# EAGLE schematic voltage_sensor_v0.2 (EAGLE 9.6.2)
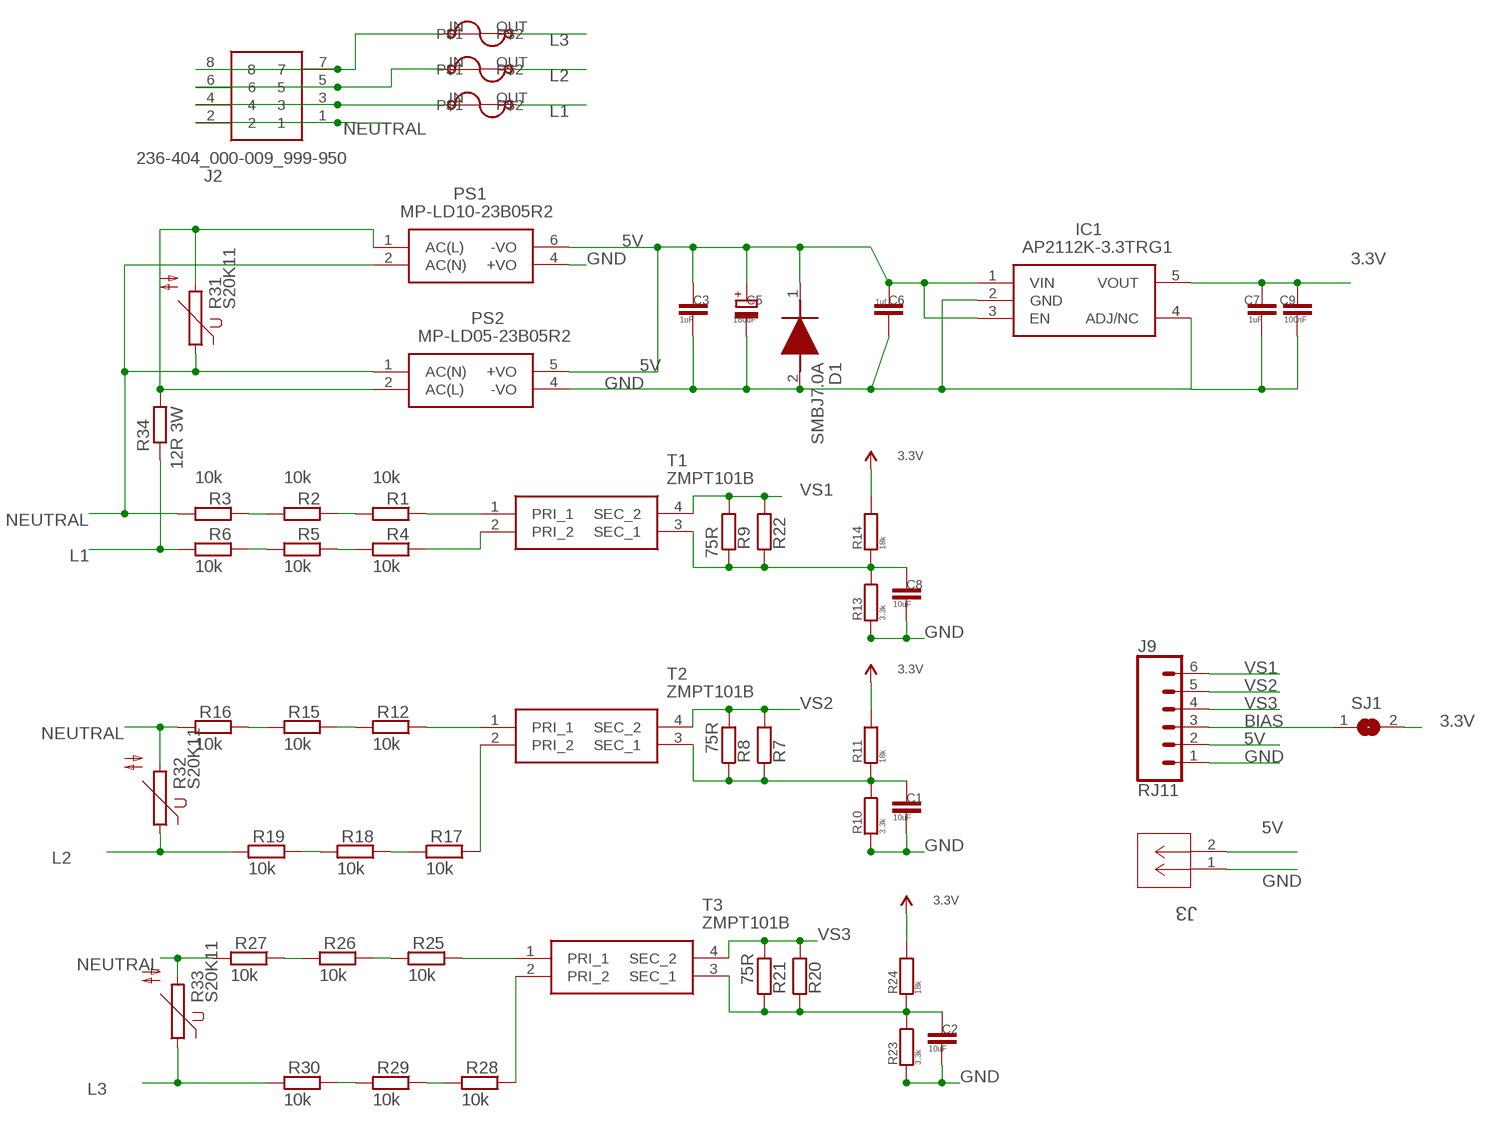
[diagram p0: schematic, sheet 1]

## Parts
C1  10uF  C-EUC0603  [C0603]
C2  10uF  C-EUC0603  [C0603]
C3  1uF  C-EUC0603  [C0603]
C5  180uF  CPOL-EUB  [PANASONIC_B]
C6  1uf  C-EUC0603  [C0603]
C7  1uF  C-EUC0603  [C0603]
C8  10uF  C-EUC0603  [C0603]
C9  100nF  C-EUC0603  [C0603]
D1  SMBJ7.0A  [DIOM5336X244N]
F1  2A/250V  BEL1AFUSE  [BELFUSE1A]
F2  2A/250V  BEL1AFUSE  [BELFUSE1A]
F3  2A/250V  BEL1AFUSE  [BELFUSE1A]
IC1  AP2112K-3.3TRG1  [SOT95P282X130-5N]
J2  236-404_000-009_999-950  [236404000009999950]
J3  MC000048  [CONN2_00048_MTC]
J9  RJ11  RJ11-6  [RJ11-6]
PS1  MP-LD10-23B05R2  MP-LD10-23B12R2  [MPLD1023B12R2]
PS2  MP-LD05-23B05R2  MP-LD05-23B03R2  [MPLD0523B03R2]
R1  10k  R-EU_R0603  [R0603]
R2  10k  R-EU_R0603  [R0603]
R3  10k  R-EU_R0603  [R0603]
R4  10k  R-EU_R0603  [R0603]
R5  10k  R-EU_R0603  [R0603]
R6  10k  R-EU_R0603  [R0603]
R7  R-EU_0204/7  [0204/7]
R8  75R  R-EU_R0603  [R0603]
R9  75R  R-EU_R0603  [R0603]
R10  3.3k  R-EU_R0603  [R0603]
R11  18k  R-EU_R0603  [R0603]
R12  10k  R-EU_R0603  [R0603]
R13  3.3k  R-EU_R0603  [R0603]
R14  18k  R-EU_R0603  [R0603]
R15  10k  R-EU_R0603  [R0603]
R16  10k  R-EU_R0603  [R0603]
R17  10k  R-EU_R0603  [R0603]
R18  10k  R-EU_R0603  [R0603]
R19  10k  R-EU_R0603  [R0603]
R20  R-EU_0204/7  [0204/7]
R21  75R  R-EU_R0603  [R0603]
R22  R-EU_0204/7  [0204/7]
R23  3.3k  R-EU_R0603  [R0603]
R24  18k  R-EU_R0603  [R0603]
R25  10k  R-EU_R0603  [R0603]
R26  10k  R-EU_R0603  [R0603]
R27  10k  R-EU_R0603  [R0603]
R28  10k  R-EU_R0603  [R0603]
R29  10k  R-EU_R0603  [R0603]
R30  10k  R-EU_R0603  [R0603]
R31  S20K11  [S20K11]
R32  S20K11  [S20K11]
R33  S20K11  [S20K11]
R34  12R 3W  R-EU_R2512  [R2512]
SJ1  SJ  [SJ]
T1  ZMPT101B  [ZMPT101B]
T2  ZMPT101B  [ZMPT101B]
T3  ZMPT101B  [ZMPT101B]

## Nets
3.3V: C7.1 C9.1 IC1.5(VOUT) R11.2 R14.2 R24.2 SJ1.2
5V: C3.1 C5.+ C6.1 D1.1(K) IC1.1(VIN) IC1.3(EN) J3.2 J9.2 PS1.6(-VO) PS2.5(+VO)
BIAS: J9.3 SJ1.1
GND: C1.2 C2.2 C3.2 C5.- C6.2 C7.2 C8.2 C9.2 D1.2(A) IC1.2(GND) IC1.4(ADJ/NC) J3.1 J9.1 PS1.4(+VO) PS2.4(-VO) R10.2 R13.2 R23.2
L1: F1.OUT R6.2 R34.1
L2: F2.OUT R19.2 R32.1
L3: F3.OUT R30.2 R33.1
N$1: R1.1 T1.1(PRI_1)
N$2: R4.1 T1.2(PRI_2)
N$3: R1.2 R2.1
N$4: R4.2 R5.1
N$5: R5.2 R6.1
N$6: R2.2 R3.1
N$7: F1.IN J2.3 J2.4
N$8: F2.IN J2.5 J2.6
N$9: C1.1 R7.1 R8.1 R10.1 R11.1 T2.3(SEC_1)
N$10: R12.1 T2.1(PRI_1)
N$11: R17.1 T2.2(PRI_2)
N$12: R12.2 R15.1
N$13: R17.2 R18.1
N$14: R18.2 R19.1
N$15: R15.2 R16.1
N$16: F3.IN J2.7 J2.8
N$17: PS1.1(AC(L)) PS2.2(AC(L)) R31.2 R34.2
N$18: C2.1 R20.1 R21.1 R23.1 R24.1 T3.3(SEC_1)
N$19: R25.1 T3.1(PRI_1)
N$20: R28.1 T3.2(PRI_2)
N$21: R25.2 R26.1
N$22: R28.2 R29.1
N$23: R29.2 R30.1
N$24: R26.2 R27.1
N$25: C8.1 R9.1 R13.1 R14.1 R22.1 T1.3(SEC_1)
NEUTRAL: J2.1 J2.2 PS1.2(AC(N)) PS2.1(AC(N)) R3.2 R16.2 R27.2 R31.1 R32.2 R33.2
VS1: J9.6 R9.2 R22.2 T1.4(SEC_2)
VS2: J9.5 R7.2 R8.2 T2.4(SEC_2)
VS3: J9.4 R20.2 R21.2 T3.4(SEC_2)

## Library data of the parts
C1-C3 C6-C9 = resistor:C-EU: CAPACITOR, European symbol
C5 = rcl:CPOL-EU: POLARIZED CAPACITOR, European symbol; SPICEPREFIX: C
D1 = SMBJ7.0A:SMBJ7.0A: TVS, SMD, 600W, 7V HY Electronic Corp SMBJ7.0A Uni-Directional TVS Diode, 600 (Min.)W peak, 2-Pin SMB Source: Datasheet; DESCRIPTION: TVS, SMD, 600W, 7V HY Electronic Corp SMBJ7.0A Uni-Directional TVS Diode, 600 (Min.)W peak, 2-Pin SMB; HEIGHT: 2.44mm; MANUFACTURER_NAME: HY Electronic Corp; MANUFACTURER_PART_NUMBER: SMBJ7.0A
F1-F3 = Qxd:BEL1AFUSE
IC1 = AP2112K-3.3TRG1:AP2112K-3.3TRG1: 600mA 3.3V LDO Regulator Enable SOT23-5 DiodesZetex AP2112K-3.3TRG1, LDO Voltage Regulator, 3.3 V +/-1.5%, 2.5 6 Vin, 5-Pin SOT-23 Source: Datasheet <http://uk.rs-online.com/web/p/products/8283509>; ARROW_PART_NUMBER: AP2112K-3.3TRG1; ARROW_PRICE-STOCK: https://www.arrow.com/en/products/ap2112k-3.3trg1/diodes-incorporated?region=nac; DESCRIPTION: 600mA 3.3V LDO Regulator Enable SOT23-5 DiodesZetex AP2112K-3.3TRG1, LDO Voltage Regulator, 3.3 V +/-1.5%, 2.5 6 Vin, 5-Pin SOT-23; HEIGHT: 1.3mm; MANUFACTURER_NAME: Diodes Inc.; MANUFACTURER_PART_NUMBER: AP2112K-3.3TRG1; MOUSER_PART_NUMBER: 621-AP2112K-3.3TRG1; MOUSER_PRICE-STOCK: https://www.mouser.co.uk/ProductDetail/Diodes-Incorporated/AP2112K-33TRG1?qs=x6A8l6qLYDDPYHosCdzh%2FA%3D%3D
J2 = 236-404_000-009_999-950:236-404_000-009_999-950: PCB TERMINAL STRIP, 2 SOLDER PINS/POLE, 4-POLE Source: Datasheet <https://www.wago.com/us/pcb-interconnect/ex-e-ii-pcb-terminal-strip/p/236-404_000-009_999-950>; ARROW_PART_NUMBER: J2; ARROW_PRICE-STOCK: https://www.arrow.com/en/products/236-404000-009999-950/wago-kontakttechnik-gmbh; DESCRIPTION: PCB TERMINAL STRIP, 2 SOLDER PINS/POLE, 4-POLE; HEIGHT: 13mm; MANUFACTURER_NAME: Wago; MANUFACTURER_PART_NUMBER: 236-404/000-009/999-950
J3 = 5mm-terminal:MC000048; COPYRIGHT: Copyright (C) 2022 Ultra Librarian. All rights reserved.; MANUFACTURER_PART_NUMBER: MC000048; MFR_NAME: Multicomp
J9 = SparkFun-Connectors:RJ11-6: RJ11 Jack - 6 pin Commonly found on CAT3 devices and some Microchip programmers. Here is the connector we sell at SparkFun: RJ11 6-Pin Connector <https://www.sparkfun.com/products/132> (PRT-00132) Datasheet <http://www.sparkfun.com/datasheets/Prototyping/Connectors/RJ11-Datasheet.pdf> It is used on this SparkFun product: SparkFun Weather Shield <https://www.sparkfun.com/products/12081> (DEV-12081) Weather Meters <https://www.sparkfun.com/products/8942> (SEN-08942); PROD_ID: CONN-08590; SF_ID: PRT-00132
PS1 = MP-LD10-23B12R2:MP-LD10-23B12R2: MULTICOMP PRO - MP-LD10-23B05R2 - AC/DC PCB Mount Power Supply (PSU), 100 to 430VDC, ITE, Household, Medical & Transformers, 5V Output Source: Datasheet <https://componentsearchengine.com/Datasheets/2/MP-LD10-23B05R2.pdf>; DESCRIPTION: MULTICOMP PRO - MP-LD10-23B12R2 - AC/DC PCB Mount Power Supply (PSU), 100 to 430VDC, ITE, Household, Medical & Transformers, 1 Output; HEIGHT: 21.5mm; MANUFACTURER_NAME: MULTICOMP; MANUFACTURER_PART_NUMBER: MP-LD10-23B05R2
PS2 = MP-LD05-23B03R2:MP-LD05-23B03R2: POWER SUPPLY, AC-DC, 3.3V, 1.515A Source: Datasheet <https://www.farnell.com/datasheets/3167202.pdf>; DESCRIPTION: POWER SUPPLY, AC-DC, 3.3V, 1.515A; HEIGHT: 18.1mm; MANUFACTURER_NAME: MULTICOMP; MANUFACTURER_PART_NUMBER: MP-LD05-23B03R2
R1-R30 = rcl:R-EU_: RESISTOR, European symbol
R31-R33 = varistor:S20K11: VARISTOR
R34 = rcl:R-EU_: RESISTOR, European symbol; SPICEPREFIX: R
SJ1 = jumper:SJ: SMD solder JUMPER
T1-T3 = ZMPT101B:ZMPT101B: Current-type Voltage Transformer Source: Datasheet; DESCRIPTION: Current-type Voltage Transformer; HEIGHT: 18.8mm; MANUFACTURER_NAME: Qingxian Zeming Langxi Electronic; MANUFACTURER_PART_NUMBER: ZMPT101B

## Net classes
0 default: clearance 0.205 mm
1 power: width 0.305 mm, drill 0.6 mm, clearance 0.254 mm
2 gnd: width 0.254 mm, drill 0.6 mm, clearance 0.254 mm